# Altium schematic sheet SensWear_Touch.SchDoc
size A4; Size: A4; SheetNumber: 1; SheetTotal: 1
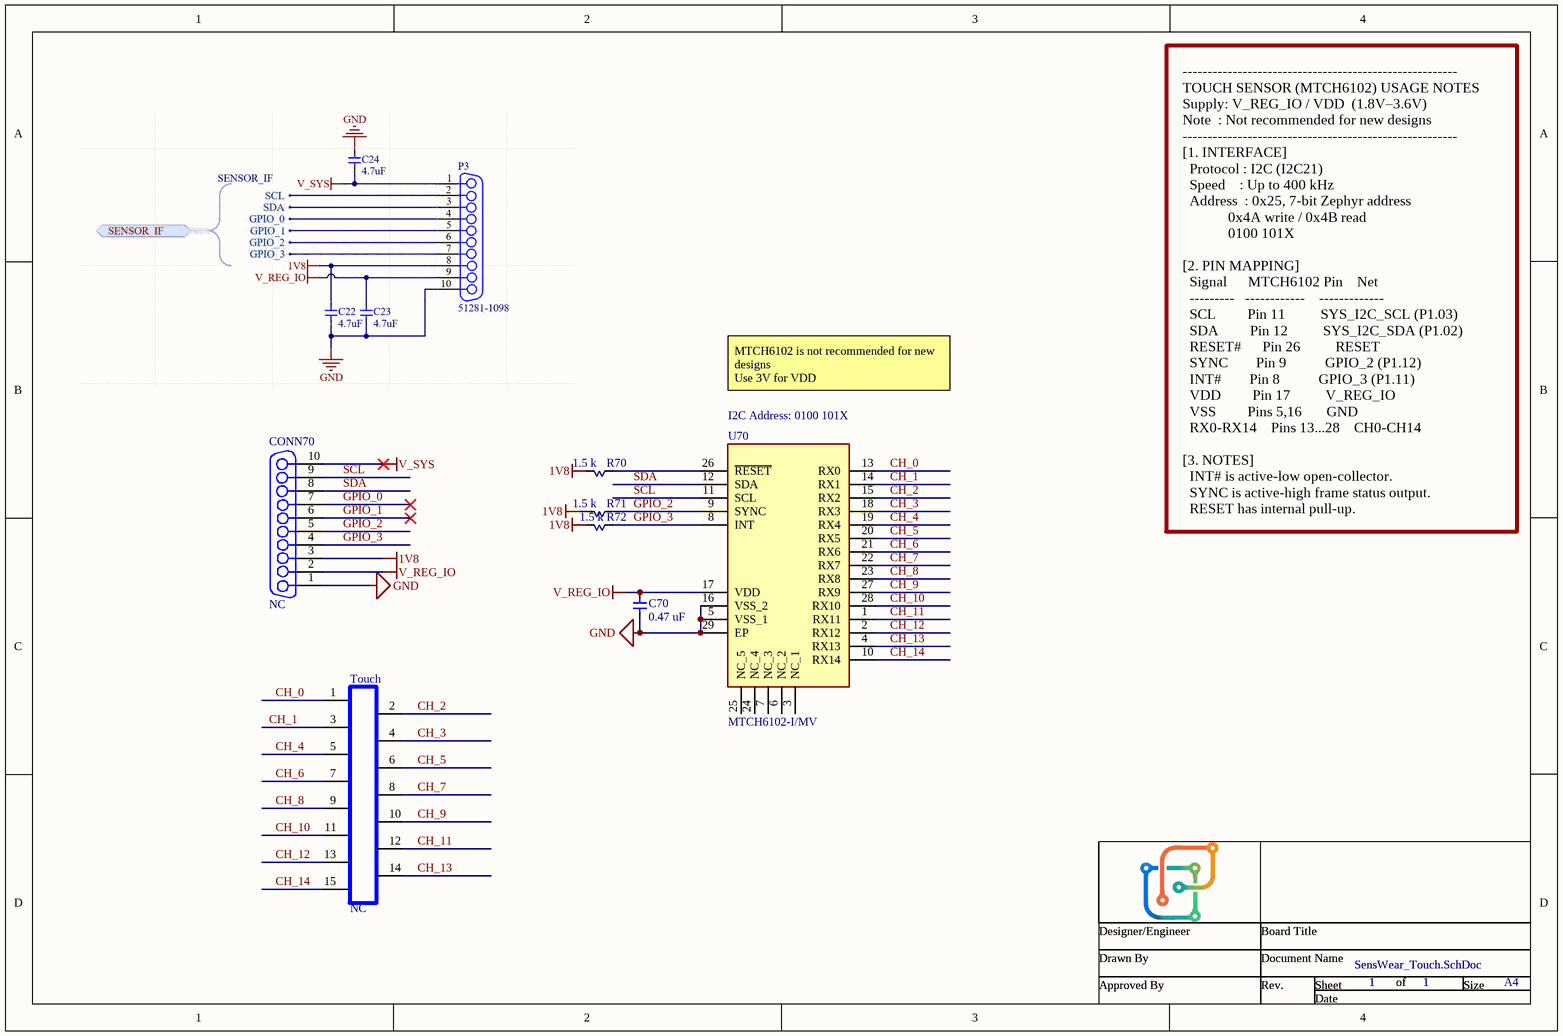
[diagram p0: SensWear_Touch.SchDoc]

## Parts
C70  0.47 uF  [CAPC1005X05N]
CONN70  NC  [51281-1098-PCB]
R70  1.5 k  [RESC1005X04N]
R71  1.5 k  [RESC1005X04N]
R72  1.5 k  [RESC1005X04N]
Touch  NC  [Touch-15Ch-Linear]
U70  MTCH6102-I/MV  [QFN40P400X400X55_HS-29N]

## Nets
1V8: CONN70.3 R70.2 R71.2 R72.2
GND: C70.2 CONN70.1 U70.5(VSS_1) U70.16(VSS_2) U70.29(EP)
V_REG_IO: C70.1 CONN70.2 U70.17(VDD)
V_SYS: CONN70.10
CH_0: Touch.1 U70.13(RX0)
CH_1: Touch.3 U70.14(RX1)
CH_2: Touch.2 U70.15(RX2)
CH_3: Touch.4 U70.18(RX3)
CH_4: Touch.5 U70.19(RX4)
CH_5: Touch.6 U70.20(RX5)
CH_6: Touch.7 U70.21(RX6)
CH_7: Touch.8 U70.22(RX7)
CH_8: Touch.9 U70.23(RX8)
CH_9: Touch.10 U70.27(RX9)
CH_10: Touch.11 U70.28(RX10)
CH_11: Touch.12 U70.1(RX11)
CH_12: Touch.13 U70.2(RX12)
CH_13: Touch.14 U70.4(RX13)
CH_14: Touch.15 U70.10(RX14)
GPIO_0: CONN70.7
GPIO_1: CONN70.6
GPIO_2: CONN70.5 R71.1 U70.9(SYNC)
GPIO_3: CONN70.4 R72.1 U70.8(INT)
SCL: CONN70.9 U70.11(SCL)
SDA: CONN70.8 U70.12(SDA)
NetR70_1: R70.1 U70.26(~{RESET})

Not connected (* = marked no-connect by the designer): U70 3(NC_1) 6(NC_2) 7(NC_3) 24(NC_4) 25(NC_5)

## Notes on the sheet
- MTCH6102 is not recommended for new designs
  Use 3V for VDD
- (near U70) I2C Address: 0100 101X
- -------------------------------------------------------
  TOUCH SENSOR (MTCH6102) USAGE NOTES
  Supply: V_REG_IO / VDD  (1.8V–3.6V)
  Note  : Not recommended for new designs
  -------------------------------------------------------
  [1. INTERFACE]
  Protocol : I2C (I2C21)
  Speed    : Up to 400 kHz
  Address  : 0x25, 7-bit Zephyr address
  0x4A write / 0x4B read
  0100 101X
  [2. PIN MAPPING]
  Signal      MTCH6102 Pin    Net
  ---------   ------------    -------------
  SCL         Pin 11          SYS_I2C_SCL (P1.03)
  SDA         Pin 12          SYS_I2C_SDA (P1.02)
  RESET#      Pin 26          RESET
  SYNC        Pin 9           GPIO_2 (P1.12)
  INT#        Pin 8           GPIO_3 (P1.11)
  VDD         Pin 17          V_REG_IO
  VSS         Pins 5,16       GND
  RX0-RX14    Pins 13...28    CH0-CH14
  [3. NOTES]
  INT# is active-low open-collector.
  SYNC is active-high frame status output.
  RESET has internal pull-up.
- Designer/Engineer
- Drawn By
- Document Name
- Board Title
- Sheet
- of
- Size
- A4
- Approved By
- Rev.
- Date

## Library data of the parts
C70 = GRM155R61A474KE15D: CAP CER 0.47UF 10V X5R 0402; Manufacturer: Murata Electronics North America; Capacitance: 0.47µF; Tolerance: ±10%; Supplier 1: Digi-Key; Manufacturer Part Number: GRM155R61A474KE15D; RoHS: RoHS Compliant; Category: Capacitors; Stock 1: 715573; Pricing 1: 1=0.08, 10=0.054, 50=0.029, 100=0.0246, 250=0.02008, 500=0.01718, 1000=0.01339, 5000=0.01116 (GBP); Packaging: Digi-Reel®; Part Status: Active; Voltage - Rated: 10V; Temperature Coefficient: X5R; Mounting Type: Surface Mount, MLCC; Operating Temperature: -55°C ~ 85°C; Applications: General Purpose; Ratings: -; Package / Case: 0402 (1005 Metric); Size / Dimension: 0.039" L x 0.020" W (1.00mm x 0.50mm); Height - Seated (Max): -; Thickness (Max): 0.022" (0.55mm); Lead Spacing: -; Features: -; Lead Style: -; ComponentLink1URL: http://www.murata.com/~/media/webrenewal/support/library/catalog/products/capacitor/mlcc/c02e.pdf; ComponentLink1Description: http://www.murata.com/~/media/webrenewal/support/library/catalog/products/capacitor/mlcc/c02e.pdf; Supplier Part Number 1: 490-3264-6-ND; Value: 0.47 uF
CONN70 = 51281-1098-PCB: System: Connector
R70-R72 = ERJ-2RKF1501X: RES SMD 1.5K OHM 1% 1/10W 0402; Manufacturer: Panasonic Electronic Components; Power (Watts): 0.1W, 1/10W; Temperature Coefficient: ±100ppm/°C; Supplier 1: Digi-Key; Manufacturer Part Number: ERJ-2RKF1501X; RoHS: RoHS Compliant; Category: Resistors; Stock 1: 1349197; Pricing 1: 1=0.1, 10=0.025, 25=0.018, 50=0.0136, 100=0.01, 250=0.00764, 500=0.00612, 1000=0.00451, 5000=0.00323 (USD); Packaging: Digi-Reel®; Part Status: Active; Resistance (Ohms): 1.5k; Tolerance: ±1%; Composition: Thick Film; Features: Automotive AEC-Q200; Operating Temperature: -55°C ~ 155°C; Package / Case: 0402 (1005 Metric); Supplier Device Package: 0402; Size / Dimension: 0.039" L x 0.020" W (1.00mm x 0.50mm); Height - Seated (Max): 0.016" (0.40mm); Number of Terminations: 2; Failure Rate: -; ComponentLink1URL: https://industrial.panasonic.com/cdbs/www-data/pdf/RDA0000/AOA0000C283.pdf; ComponentLink1Description: https://industrial.panasonic.com/cdbs/www-data/pdf/RDA0000/AOA0000C283.pdf; Supplier Part Number 1: P1.50KLDKR-ND; Value: 1.5 k
Touch = Touch-15Ch-Linear
U70 = MTCH6102-I/MV: Capacitive Touch Screen Automotive 28-Pin UQFN EP Tube; Manufacturer: Microchip; Checked: FALSE; Supplier: Digikey; Supplier Part Number: MTCH6102-I/MV-ND; Manufacturer Part Number: MTCH6102-I/MV; RoHS: Yes; Category: Touch Screen Controllers; Stock: 496; Pricing: 1=1.95, 25=1.8, 100=1.62 (USD); ComponentLink1URL: https://datasheet.ciiva.com/29355/filehandler-aspxddocname-en568912-29355091.pdf?src-supplier=Digikey; ComponentLink1Description: https://datasheet.ciiva.com/29355/filehandler-aspxddocname-en568912-29355091.pdf?src-supplier=Digikey; ComponentLink2URL: https://datasheet.ciiva.com/48495/40001750a-48495606.pdf?src-supplier=Avnet; ComponentLink2Description: https://datasheet.ciiva.com/48495/40001750a-48495606.pdf?src-supplier=Avnet; ComponentLink3URL: https://datasheet.ciiva.com/46405/1810724-46405963.pdf?src-supplier=Element14; ComponentLink3Description: https://datasheet.ciiva.com/46405/1810724-46405963.pdf?src-supplier=Element14; Supplier 1: Digikey; Supplier Part Number 1: MTCH6102-I/MV-ND; Supplier 2: Mouser; Supplier Part Number 2: 579-MTCH6102-I/MV